# Altium project RP2040_PCB_Project.PrjPcb
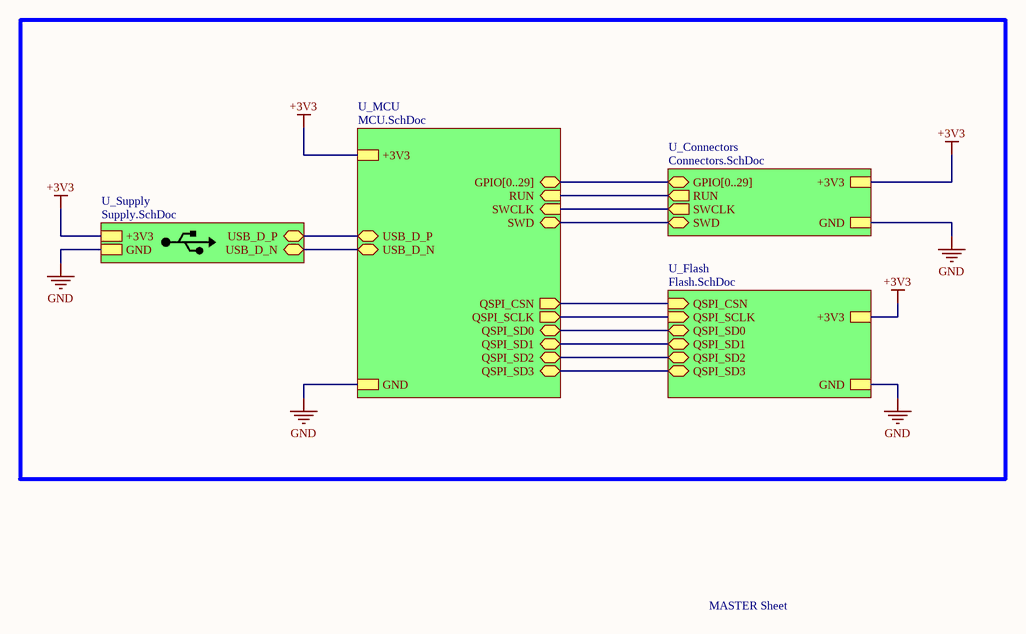
[diagram p0: Master.SchDoc]
Designer: Youssif Hossam; Project_name: RP2040 PCB Board
5 sheets, 29 parts. Net scope: hierarchical (ports join the sheet entries above them; power ports are global).
Board file: PCB1.PcbDoc
Sheets:
  Master.SchDoc
    U_Connectors = Connectors.SchDoc
    U_Flash = Flash.SchDoc
    U_MCU = MCU.SchDoc
    U_Supply = Supply.SchDoc

## Sheet Master.SchDoc
size A; SheetNumber: 1; SheetTotal: 5

### Sub-sheets
U_Connectors = Connectors.SchDoc: GPIO[0..29] (bidir), RUN (out), SWCLK (out), SWD (bidir), +3V3, GND
U_Flash = Flash.SchDoc: QSPI_CSN (in), QSPI_SCLK (in), QSPI_SD0 (bidir), QSPI_SD1 (bidir), QSPI_SD2 (bidir), QSPI_SD3 (bidir), +3V3, GND
U_MCU = MCU.SchDoc: USB_D_P (bidir), USB_D_N (bidir), GPIO[0..29] (bidir), RUN (in), SWCLK (in), SWD (bidir), QSPI_CSN (out), QSPI_SCLK (out), QSPI_SD0 (bidir), QSPI_SD1 (bidir), QSPI_SD2 (bidir), QSPI_SD3 (bidir), +3V3, GND
U_Supply = Supply.SchDoc: USB_D_P (bidir), USB_D_N (bidir), +3V3, GND

### Nets
+3V3: sheet U_Connectors/+3V3, sheet U_Flash/+3V3, sheet U_MCU/+3V3, sheet U_Supply/+3V3
GND: sheet U_Connectors/GND, sheet U_Flash/GND, sheet U_MCU/GND, sheet U_Supply/GND
CS: sheet U_Flash/QSPI_CSN, sheet U_MCU/QSPI_CSN
IO0: sheet U_Flash/QSPI_SD0, sheet U_MCU/QSPI_SD0
IO1: sheet U_Flash/QSPI_SD1, sheet U_MCU/QSPI_SD1
IO2: sheet U_Flash/QSPI_SD2, sheet U_MCU/QSPI_SD2
IO3: sheet U_Flash/QSPI_SD3, sheet U_MCU/QSPI_SD3
QSPI_SCLK: sheet U_Flash/QSPI_SCLK, sheet U_MCU/QSPI_SCLK
RUN: sheet U_Connectors/RUN, sheet U_MCU/RUN
SWCLK: sheet U_Connectors/SWCLK, sheet U_MCU/SWCLK
SWD: sheet U_Connectors/SWD, sheet U_MCU/SWD
USB_D_N: sheet U_MCU/USB_D_N, sheet U_Supply/USB_D_N
USB_D_P: sheet U_MCU/USB_D_P, sheet U_Supply/USB_D_P

### Buses and harness runs
bus sheet U_Connectors/GPIO[0..29] = sheet U_MCU/GPIO[0..29]

### Notes on the sheet
- MASTER Sheet

## Sheet Connectors.SchDoc
size A; SheetNumber: 5; SheetTotal: 5
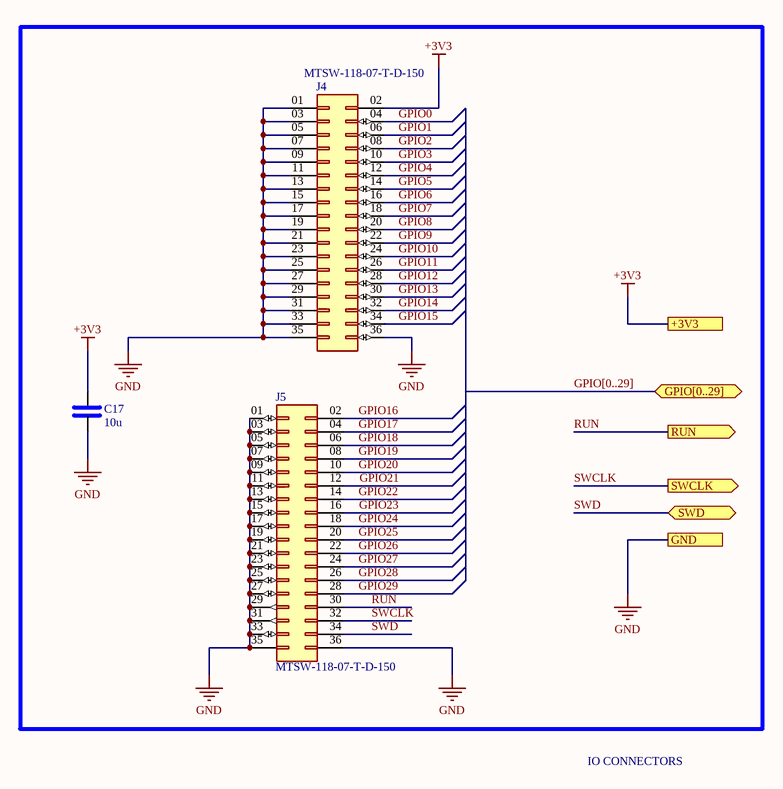
[diagram p1: Connectors.SchDoc]

### Parts
C17  10u  [VJ0805]
J4  MTSW-118-07-T-D-150  [SAMTEC_MTSW-118-07-T-D-150]
J5  MTSW-118-07-T-D-150  [SAMTEC_MTSW-118-07-T-D-150]

### Ports
+3V3 (see Master[4B], Flash[4B], MCU[1A], Supply[4B]), GND (see Master[4B], Flash[4C], MCU[1B], Supply[4C]), GPIO[0..29] (bidir, see Master[3B], MCU[4C]), RUN (out, see Master[3B], MCU[4D]), SWCLK (out, see Master[3B], MCU[4D]), SWD (bidir, see Master[3B], MCU[4D])

### Nets
+3V3: C17.2 J4.02 ; port +3V3
GND: C17.1 J4.01 J4.03 J4.05 J4.07 J4.09 J4.11 J4.13 J4.15 J4.17 J4.19 J4.21 J4.23 J4.25 J4.27 J4.29 J4.31 J4.33 J4.35 J4.36 J5.01 J5.03 J5.05 J5.07 J5.09 J5.11 J5.13 J5.15 J5.17 J5.19 J5.21 J5.23 J5.25 J5.27 J5.29 J5.31 J5.33 J5.35 J5.36 ; port GND
GPIO0: J4.04
GPIO1: J4.06
GPIO2: J4.08
GPIO3: J4.10
GPIO4: J4.12
GPIO5: J4.14
GPIO6: J4.16
GPIO7: J4.18
GPIO8: J4.20
GPIO9: J4.22
GPIO10: J4.24
GPIO11: J4.26
GPIO12: J4.28
GPIO13: J4.30
GPIO14: J4.32
GPIO15: J4.34
GPIO16: J5.02
GPIO17: J5.04
GPIO18: J5.06
GPIO19: J5.08
GPIO20: J5.10
GPIO21: J5.12
GPIO22: J5.14
GPIO23: J5.16
GPIO24: J5.18
GPIO25: J5.20
GPIO26: J5.22
GPIO27: J5.24
GPIO28: J5.26
GPIO29: J5.28
RUN: J5.30 ; port RUN
SWCLK: J5.32 ; port SWCLK
SWD: J5.34 ; port SWD

### Buses and harness runs
bus GPIO[0..29] = port GPIO[0..29]

### Notes on the sheet
- IO CONNECTORS

### Library data of the parts
C17 = 0805 SMD Capacitor: Ceramic Capacitor, Multilayer, Ceramic, 25V, 10% +Tol, 10% -Tol, X5R, 15% TC, 10uF, Surface Mount, 0805; Manufacturer: Murata; Manufacturer Part Number: GRM21BR61E106KA73K; Multilayer: Yes; ComponentLink1Description: Link; ComponentLink1URL: *; Supplier: Future Electronics; Supplier Part Number: 9092991; RoHS: Yes; Category: Ceramic Capacitors; Stock: 40000; Pricing: 10000=0.0248, 20000=0.0245, 30000=0.0242, 40000=0.0241, 50000=0.0236 (USD); Mounting Technology: Surface Mount; Pins: 2; Dielectric Material: Ceramic; Package Shape: Rectangular; Case/Package: 0805; Terminal Finish: Nickel; Min Operating Temperature: -55°C; Max Operating Temperature: 85°C; JESD-609 Code: e3; Value: 10uF; Capacitor Type: Ceramic; Tolerance  (fill in as +-): 10%; Package Style: SMTMeter; Packaging: Tape and Reel; Tolerance (fill in as +-): 10%; Rated DC Voltage (URdc): 25V; Temperature Characteristics Code: X5R; Termination: Wraparound; Length: 2mm; Width: 1.25mm; Height: 1.25mm; Reach SVHC Compliant: Yes; RoHS Compliant: Yes; ComponentLink2URL: https://datasheet.ciiva.com:443/pdfs/VipMasterIC/IC/MURE/MURE-S-A0004349797/MURE-S-A0004361627-1.pdf?src-supplier=IHS+Markit; ComponentLink2Description: https://datasheet.ciiva.com:443/pdfs/VipMasterIC/IC/MURE/MURE-S-A0004349797/MURE-S-A0004361627-1.pdf?src-supplier=IHS+Markit; ComponentLink3URL: http://www.mouser.com/ds/2/281/c02e-2905.pdf?src-supplier=Mouser; ComponentLink3Description: http://www.mouser.com/ds/2/281/c02e-2905.pdf?src-supplier=Mouser; ComponentLink4URL: https://datasheet.octopart.com/GRM21BR61E106KA73K-Murata-datasheet-149523495.pdf?src-supplier=Newark; ComponentLink4Description: https://datasheet.octopart.com/GRM21BR61E106KA73K-Murata-datasheet-149523495.pdf?src-supplier=Newark; ComponentLink5URL: https://datasheet.octopart.com/GRM21BR61E106KA73K-Murata-datasheet-99353849.pdf?src-supplier=Future+Electronics; ComponentLink5Description: https://datasheet.octopart.com/GRM21BR61E106KA73K-Murata-datasheet-99353849.pdf?src-supplier=Future+Electronics; ComponentLink6URL: http://search.murata.co.jp/Ceramy/image/img/A01X/G101/ENG/GRM21BR61E106KA73-01.pdf?src-supplier=Digikey; ComponentLink6Description: http://search.murata.co.jp/Ceramy/image/img/A01X/G101/ENG/GRM21BR61E106KA73-01.pdf?src-supplier=Digikey; ComponentLink7URL: https://search.murata.co.jp/Ceramy/image/img/A01X/G101/ENG/GRM21BR61E106KA73-01.pdf?src-supplier=Digikey; ComponentLink7Description: https://search.murata.co.jp/Ceramy/image/img/A01X/G101/ENG/GRM21BR61E106KA73-01.pdf?src-supplier=Digikey; ComponentLink8URL: https://datasheet.octopart.com/GRM21BR61E106KA73K-Murata-datasheet-165579666.pdf?src-supplier=TME; ComponentLink8Description: https://datasheet.octopart.com/GRM21BR61E106KA73K-Murata-datasheet-165579666.pdf?src-supplier=TME
J4 J5 = MTSW-118-07-T-D-150: Package: None; Price: None; Value: *; MP: MTSW-118-07-T-D-150; Availability: Unavailable

## Sheet Flash.SchDoc
size A; SheetNumber: 4; SheetTotal: 5
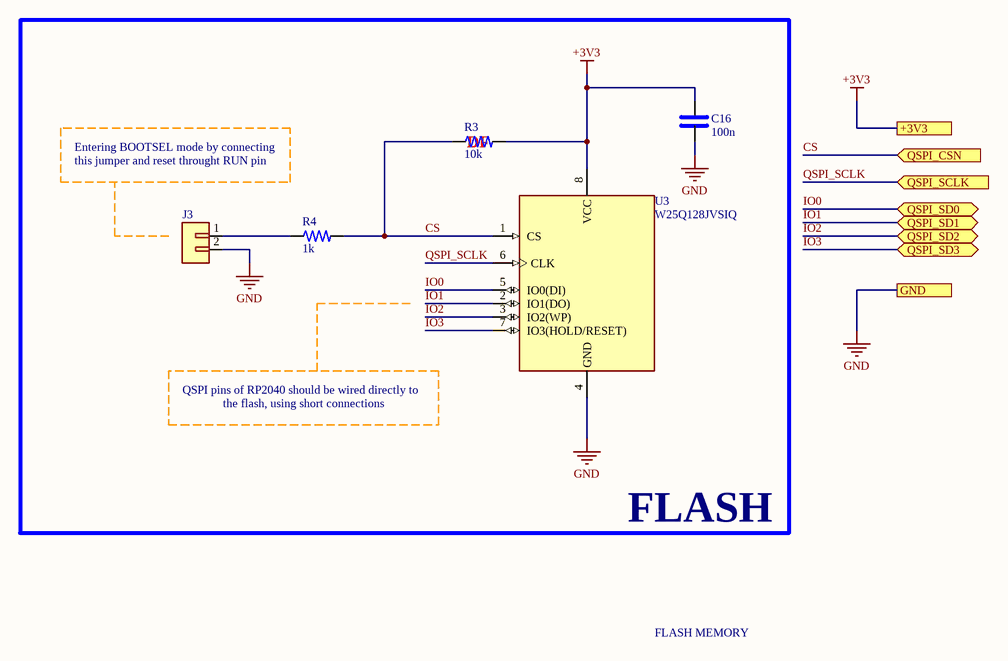
[diagram p2: Flash.SchDoc]

### Parts
C16  100n  [0402 CAP]
J3  2 Position male pin header  [SAMTEC-TMM-101-03-X-D]  (value not drawn)
R3  10k  [0402 RES]
R4  1k  [0402 RES]
U3  W25Q128JVSIQ  [SOIC127P790X216-8N]

### Ports
+3V3 (see Master[4C], Connectors[3B], MCU[1A], Supply[4B]), GND (see Master[4C], Connectors[3C], MCU[1B], Supply[4C]), QSPI_CSN (in, see Master[3C], MCU[1A]), QSPI_SCLK (in, see Master[3C], MCU[1A]), QSPI_SD0 (bidir, see Master[3C], MCU[1A]), QSPI_SD1 (bidir, see Master[3C], MCU[1A]), QSPI_SD2 (bidir, see Master[3C], MCU[1B]), QSPI_SD3 (bidir, see Master[3C], MCU[1B])

### Nets
+3V3: C16.2 R3.2 U3.8(VCC) ; port +3V3
GND: C16.1 J3.2 U3.4(GND) ; port GND
CS: R3.1 R4.2 U3.1(CS) ; port QSPI_CSN
IO0: U3.5(IO0(DI)) ; port QSPI_SD0
IO1: U3.2(IO1(DO)) ; port QSPI_SD1
IO2: U3.3(IO2(WP)) ; port QSPI_SD2
IO3: U3.7(IO3(HOLD/RESET)) ; port QSPI_SD3
QSPI_SCLK: U3.6(CLK) ; port QSPI_SCLK
NetJ3_1: J3.1 R4.1

### Notes on the sheet
- Entering BOOTSEL mode by connecting
- this jumper and reset throught RUN pin
- (near R3) DF
- (near U3) QSPI pins of RP2040 should be wired directly to
- the flash, using short connections
- FLASH
- FLASH MEMORY

### Library data of the parts
C16 = 0402 SMD Capacitor: Ceramic Capacitor, Multilayer, Ceramic, 16V, 10% +Tol, 10% -Tol, X7R, 15% TC, 0.1uF, Surface Mount, 0805; Manufacturer: KEMET; Manufacturer Part Number: C0805C104K4RACTU; Value: 100nF; Multilayer: Yes; ComponentLink1Description: Link; ComponentLink1URL: *; Supplier: Mouser; Supplier Part Number: 80-C0805C104K4R; RoHS: Yes; Category: Ceramic Capacitors; Stock: 114893; Pricing: 1=0.16, 10=0.078, 50=0.078, 100=0.045, 1000=0.034, 10000=0.024 (USD); Mounting Technology: Surface Mount; Pins: 2; Dielectric Material: Ceramic; Package Shape: Rectangular; Case/Package: 0805; Terminal Finish: Nickel; Min Operating Temperature: -55°C; Max Operating Temperature: 125°C; JESD-609 Code: e3; Capacitor Type: Ceramic; Tolerance  (fill in as +-): 10%; Packaging: Tape and Reel; Tolerance (fill in as +-): 10%; Rated DC Voltage (URdc): 16V; Temperature Characteristics Code: X7R; Termination: Wraparound; Reach SVHC Compliant: Yes; RoHS Compliant: Yes; ComponentLink2URL: https://datasheet.ciiva.com:443/pdfs/VipMasterIC/IC/KEME/KEME-S-A0006434815/KEME-S-A0006434815-1.pdf?src-supplier=IHS+Markit; ComponentLink2Description: https://datasheet.ciiva.com:443/pdfs/VipMasterIC/IC/KEME/KEME-S-A0006434815/KEME-S-A0006434815-1.pdf?src-supplier=IHS+Markit; ComponentLink3URL: https://datasheet.ciiva.com/46443/1851736-46443711.pdf?src-supplier=Element14; ComponentLink3Description: https://datasheet.ciiva.com/46443/1851736-46443711.pdf?src-supplier=Element14; ComponentLink4URL: https://datasheet.ciiva.com/46443/1851736-46443710.pdf?src-supplier=Element14; ComponentLink4Description: https://datasheet.ciiva.com/46443/1851736-46443710.pdf?src-supplier=Element14
J3 = SAMTEC-TMM-101-03-X-D
R3 = 0402 SMD Resistor: Fixed Resistor, Metal Glaze/thick Film, 0.125W, 10000ohm, 150V, 10% +/-Tol, 100ppm/Cel, Surface Mount, 0805; Manufacturer: Yageo; Manufacturer Part Number: SR0805KR-0710KL; ComponentLink1Description: Link; ComponentLink1URL: *; Supplier: Digikey; Supplier Part Number: 13-SR0805KR-0710KLCT-ND; RoHS: Yes; Category: Chip SMD Resistors; Stock: 10000; Pricing: 1=0.15, 10=0.08, 50=0.0632, 100=0.0469, 500=0.03468, 1000=0.0306 (USD); ComponentLink2URL: https://datasheet.ciiva.com:443/pdfs/VipMasterIC/IC/YAGO/YAGO-S-A0006645500/YAGO-S-A0006645500-1.pdf?src-supplier=IHS+Markit; ComponentLink2Description: https://datasheet.ciiva.com:443/pdfs/VipMasterIC/IC/YAGO/YAGO-S-A0006645500/YAGO-S-A0006645500-1.pdf?src-supplier=IHS+Markit; ComponentLink3URL: http://www.yageo.com/documents/recent/PYu-SR_20105_RoHS_L_5.pdf?src-supplier=Digikey; ComponentLink3Description: http://www.yageo.com/documents/recent/PYu-SR_20105_RoHS_L_5.pdf?src-supplier=Digikey
R4 = 0402 SMD Resistor: Fixed Resistor, Metal Glaze/thick Film, 0.125W, 1000ohm, 150V, 1% +/-Tol, 100ppm/Cel, Surface Mount, 0805; Manufacturer: Yageo; Manufacturer Part Number: RC0805FR-071KL; Additional Feature: LASER TRIMMABLE; Power: 125mW; Rated Temperature: 70°C; Value: 1kR; Temperature Coefficient: 100ppm/°C; Package Height: 0.5mm; Package Length: 2mm; Package Width: 1.25mm; ComponentLink1Description: Link; ComponentLink1URL: *; Supplier: Future Electronics; Supplier Part Number: 8126013; RoHS: Yes; Category: Chip SMD Resistors; Stock: 1400000; Pricing: 5000=0.0028, 25000=0.0027, 100000=0.0026, 250000=0.0025, 625000=0.0024 (USD); Mounting Technology: Surface Mount; Pins: 2; Package Shape: Rectangular; Case/Package: 0805; Terminal Finish: Nickel; Min Operating Temperature: -55°C; Max Operating Temperature: 155°C; JESD-609 Code: e3; Termination: Wraparound; Resistor Type: FIXED RESISTOR; Construction: Chip; Package Style: SMTMeter; Packaging: Tape and Reel; Technology: METAL GLAZE/THICK FILM; Working Voltage: 150V; Reach SVHC Compliant: Yes; RoHS Compliant: Yes; ComponentLink2URL: https://datasheet.ciiva.com:443/pdfs/VipMasterIC/IC/YAGO/YAGO-S-A0008145938/YAGO-S-A0008145938-1.pdf?src-supplier=IHS+Markit; ComponentLink2Description: https://datasheet.ciiva.com:443/pdfs/VipMasterIC/IC/YAGO/YAGO-S-A0008145938/YAGO-S-A0008145938-1.pdf?src-supplier=IHS+Markit; ComponentLink3URL: https://datasheet.ciiva.com/7941/1686128-7941719.pdf?src-supplier=Element14; ComponentLink3Description: https://datasheet.ciiva.com/7941/1686128-7941719.pdf?src-supplier=Element14
U3 = W25Q128JVSIQ: FLASH - NOR Memory IC 128Mb (16M x 8) SPI - Quad I/O, QPI, DTR 133 MHz 8-SOIC; MF: Winbond Electronics; Price: None; Purchase-URL: https://pricing.snapeda.com/search/part/W25Q128JVSIQ/?ref=eda; Check_prices: https://www.snapeda.com/parts/W25Q128JVSIQ/Winbond+Electronics/view-part/?ref=eda; Value: *; MP: W25Q128JVSIQ; Package: SOIC-8 Winbond; SnapEDA_Link: https://www.snapeda.com/parts/W25Q128JVSIQ/Winbond+Electronics/view-part/?ref=snap; Availability: In Stock

## Sheet MCU.SchDoc
size Letter; SheetNumber: 3; SheetTotal: 5
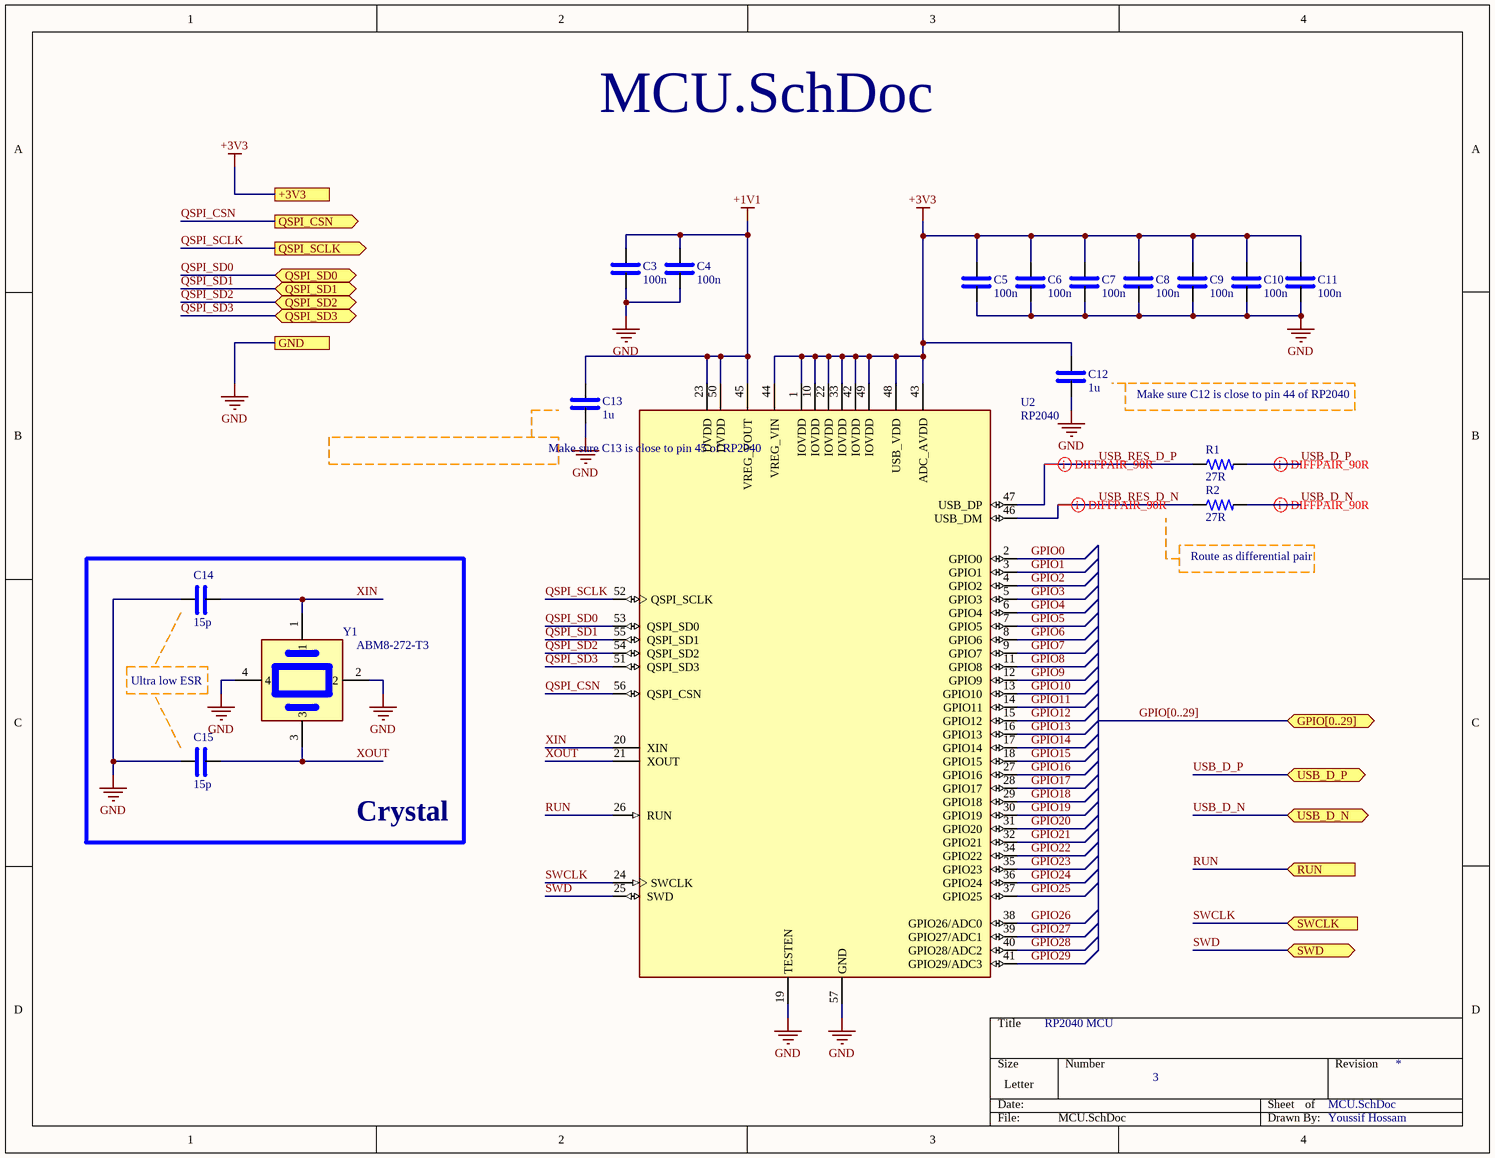
[diagram p3: MCU.SchDoc]

### Parts
C3  100n  [0402 CAP]
C4  100n  [0402 CAP]
C5  100n  [0402 CAP]
C6  100n  [0402 CAP]
C7  100n  [0402 CAP]
C8  100n  [0402 CAP]
C9  100n  [0402 CAP]
C10  100n  [0402 CAP]
C11  100n  [0402 CAP]
C12  1u  [0402 CAP]
C13  1u  [0402 CAP]
C14  15p  [0402 CAP]
C15  15p  [0402 CAP]
R1  27R  [0402 RES]
R2  27R  [0402 RES]
U2  RP2040  [QFN40P700X700X90-57N]
Y1  ABM8-272-T3  [ABM8-272-T3]

### Blocks framed on the sheet
Crystal: C14 C15 Y1

### Ports
+3V3 (see Master[2B], Connectors[3B], Flash[4B], Supply[4B]), GND (see Master[2C], Connectors[3C], Flash[4C], Supply[4C]), GPIO[0..29] (bidir, see Master[3B], Connectors[3C]), QSPI_CSN (out, see Master[3C], Flash[4B]), QSPI_SCLK (out, see Master[3C], Flash[4B]), QSPI_SD0 (bidir, see Master[3C], Flash[4B]), QSPI_SD1 (bidir, see Master[3C], Flash[4B]), QSPI_SD2 (bidir, see Master[3C], Flash[4B]), QSPI_SD3 (bidir, see Master[3C], Flash[4B]), RUN (in, see Master[3B], Connectors[3C]), SWCLK (in, see Master[3B], Connectors[3C]), SWD (bidir, see Master[3B], Connectors[3C]), USB_D_N (bidir, see Master[2C], Supply[4B]), USB_D_P (bidir, see Master[2C], Supply[4B])

### Nets
+1V1: C3.2 C4.2 C13.2 U2.23(DVDD) U2.45(VREG_VOUT) U2.50(DVDD)
+3V3: C5.2 C6.2 C7.2 C8.2 C9.2 C10.2 C11.2 C12.2 U2.1(IOVDD) U2.10(IOVDD) U2.22(IOVDD) U2.33(IOVDD) U2.42(IOVDD) U2.43(ADC_AVDD) U2.44(VREG_VIN) U2.48(USB_VDD) U2.49(IOVDD) ; port +3V3
GND: C3.1 C4.1 C5.1 C6.1 C7.1 C8.1 C9.1 C10.1 C11.1 C12.1 C13.1 C14.2 C15.2 U2.19(TESTEN) U2.57(GND) Y1.2 Y1.4 ; port GND
GPIO0: U2.2(GPIO0)
GPIO1: U2.3(GPIO1)
GPIO2: U2.4(GPIO2)
GPIO3: U2.5(GPIO3)
GPIO4: U2.6(GPIO4)
GPIO5: U2.7(GPIO5)
GPIO6: U2.8(GPIO6)
GPIO7: U2.9(GPIO7)
GPIO8: U2.11(GPIO8)
GPIO9: U2.12(GPIO9)
GPIO10: U2.13(GPIO10)
GPIO11: U2.14(GPIO11)
GPIO12: U2.15(GPIO12)
GPIO13: U2.16(GPIO13)
GPIO14: U2.17(GPIO14)
GPIO15: U2.18(GPIO15)
GPIO16: U2.27(GPIO16)
GPIO17: U2.28(GPIO17)
GPIO18: U2.29(GPIO18)
GPIO19: U2.30(GPIO19)
GPIO20: U2.31(GPIO20)
GPIO21: U2.32(GPIO21)
GPIO22: U2.34(GPIO22)
GPIO23: U2.35(GPIO23)
GPIO24: U2.36(GPIO24)
GPIO25: U2.37(GPIO25)
GPIO26: U2.38(GPIO26/ADC0)
GPIO27: U2.39(GPIO27/ADC1)
GPIO28: U2.40(GPIO28/ADC2)
GPIO29: U2.41(GPIO29/ADC3)
QSPI_CSN: U2.56(QSPI_CSN) ; port QSPI_CSN  [project net CS]
QSPI_SCLK: U2.52(QSPI_SCLK) ; port QSPI_SCLK
QSPI_SD0: U2.53(QSPI_SD0) ; port QSPI_SD0  [project net IO0]
QSPI_SD1: U2.55(QSPI_SD1) ; port QSPI_SD1  [project net IO1]
QSPI_SD2: U2.54(QSPI_SD2) ; port QSPI_SD2  [project net IO2]
QSPI_SD3: U2.51(QSPI_SD3) ; port QSPI_SD3  [project net IO3]
RUN: U2.26(RUN) ; port RUN
SWCLK: U2.24(SWCLK) ; port SWCLK
SWD: U2.25(SWD) ; port SWD
USB_D_N: R2.2 ; port USB_D_N
USB_D_P: R1.2 ; port USB_D_P
USB_RES_D_N: R2.1 U2.46(USB_DM)
USB_RES_D_P: R1.1 U2.47(USB_DP)
XIN: C14.1 U2.20(XIN) Y1.1
XOUT: C15.1 U2.21(XOUT) Y1.3

### Buses and harness runs
bus GPIO[0..29] = port GPIO[0..29]

### Layout directives
differential pair; differential pair class USB: USB_D_N, USB_D_P, USB_RES_D_N, USB_RES_D_P

### Notes on the sheet
- Make sure C12 is close to pin 44 of RP2040
- (near C13) Make sure C13 is close to pin 45 of RP2040
- (near R2) Route as differential pair
- Ultra low ESR
- RP2040 MCU

### Library data of the parts
C3-C11 = 0402 SMD Capacitor: as C16 on sheet Flash; ComponentLink1Description: Link; ComponentLink1URL: *; Supplier: Mouser; Supplier Part Number: 80-C0805C104K4R; RoHS: Yes; Category: Ceramic Capacitors; Stock: 114893; Pricing: 1=0.16, 10=0.078, 50=0.078, 100=0.045, 1000=0.034, 10000=0.024 (USD); Mounting Technology: Surface Mount; Pins: 2; Dielectric Material: Ceramic; Package Shape: Rectangular; Case/Package: 0805; Terminal Finish: Nickel; Min Operating Temperature: -55°C; Max Operating Temperature: 125°C; JESD-609 Code: e3; Capacitor Type: Ceramic; Tolerance  (fill in as +-): 10%; Packaging: Tape and Reel; Tolerance (fill in as +-): 10%; Rated DC Voltage (URdc): 16V; Temperature Characteristics Code: X7R; Termination: Wraparound; Reach SVHC Compliant: Yes; RoHS Compliant: Yes; ComponentLink2URL: https://datasheet.ciiva.com:443/pdfs/VipMasterIC/IC/KEME/KEME-S-A0006434815/KEME-S-A0006434815-1.pdf?src-supplier=IHS+Markit; ComponentLink2Description: https://datasheet.ciiva.com:443/pdfs/VipMasterIC/IC/KEME/KEME-S-A0006434815/KEME-S-A0006434815-1.pdf?src-supplier=IHS+Markit; ComponentLink3URL: https://datasheet.ciiva.com/46443/1851736-46443711.pdf?src-supplier=Element14; ComponentLink3Description: https://datasheet.ciiva.com/46443/1851736-46443711.pdf?src-supplier=Element14; ComponentLink4URL: https://datasheet.ciiva.com/46443/1851736-46443710.pdf?src-supplier=Element14; ComponentLink4Description: https://datasheet.ciiva.com/46443/1851736-46443710.pdf?src-supplier=Element14
C12 C13 = 0402 SMD Capacitor: Ceramic Capacitor, Multilayer, Ceramic, 16V, 10% +Tol, 10% -Tol, X7R, 15% TC, 1uF, Surface Mount, 0805; Manufacturer: KEMET; Manufacturer Part Number: C0805C105K4RACTU; Multilayer: Yes; ComponentLink1Description: Link; ComponentLink1URL: *; Supplier: Mouser; Supplier Part Number: 80-C0805C105K4R; RoHS: Yes; Category: Ceramic Capacitors; Stock: 298617; Pricing: 1=0.11, 10=0.07, 50=0.07, 100=0.046, 1000=0.041, 10000=0.018 (USD); Mounting Technology: Surface Mount; Pins: 2; Dielectric Material: Ceramic; Package Shape: Rectangular; Case/Package: 0805; Terminal Finish: Nickel; Min Operating Temperature: -55°C; Max Operating Temperature: 125°C; JESD-609 Code: e3; Value: 1uF; Capacitor Type: Ceramic; Tolerance  (fill in as +-): 10%; Packaging: Tape and Reel; Tolerance (fill in as +-): 10%; Rated DC Voltage (URdc): 16V; Temperature Characteristics Code: X7R; Termination: Wraparound; Package Style: SMTMeter; Length: 2mm; Width: 1.25mm; Height: 0.9mm; Reach SVHC Compliant: Yes; RoHS Compliant: Yes; ComponentLink2URL: https://datasheet.ciiva.com:443/pdfs/VipMasterIC/IC/KEME/KEME-S-A0008991654/KEME-S-A0008991654-1.pdf?src-supplier=IHS+Markit; ComponentLink2Description: https://datasheet.ciiva.com:443/pdfs/VipMasterIC/IC/KEME/KEME-S-A0008991654/KEME-S-A0008991654-1.pdf?src-supplier=IHS+Markit; ComponentLink3URL: https://datasheet.ciiva.com/6074/1722731-6074364.pdf?src-supplier=Farnell; ComponentLink3Description: https://datasheet.ciiva.com/6074/1722731-6074364.pdf?src-supplier=Farnell; ComponentLink4URL: https://datasheet.ciiva.com/28692/1851736-28692942.pdf?src-supplier=Element14; ComponentLink4Description: https://datasheet.ciiva.com/28692/1851736-28692942.pdf?src-supplier=Element14; ComponentLink5URL: https://datasheet.ciiva.com/14585/70095383-14585511.pdf?src-supplier=Allied+Electronics; ComponentLink5Description: https://datasheet.ciiva.com/14585/70095383-14585511.pdf?src-supplier=Allied+Electronics; ComponentLink6URL: https://datasheet.ciiva.com/14603/70095383-14603388.pdf?src-supplier=Allied+Electronics; ComponentLink6Description: https://datasheet.ciiva.com/14603/70095383-14603388.pdf?src-supplier=Allied+Electronics; ComponentLink7URL: https://datasheet.ciiva.com/45846/docfinderpartnumberc0402c102k5ractu-45846934.pdf?src-supplier=Onlinecomponents.com; ComponentLink7Description: https://datasheet.ciiva.com/45846/docfinderpartnumberc0402c102k5ractu-45846934.pdf?src-supplier=Onlinecomponents.com
C14 C15 = 0402 SMD Capacitor: Ceramic Capacitor, Multilayer, Ceramic, 50V, 1% +Tol, 1% -Tol, C0G, 30ppm/Cel TC, 0.000015uF, Surface Mount, 0805; Manufacturer: Yageo; Manufacturer Part Number: CC0805FRNPO9BN150; Value: 15pF; Multilayer: Yes; ComponentLink1Description: Link; ComponentLink1URL: *; Supplier: Future Electronics; Supplier Part Number: 8396681; RoHS: Yes; Category: Ceramic Capacitors; Stock: 8000; Pricing: 4000=0.0258, 12000=0.0252, 20000=0.0249, 60000=0.0243, 100000=0.0238 (USD); Mounting Technology: Surface Mount; Pins: 2; Dielectric Material: Ceramic; Package Shape: Rectangular; Case/Package: 0805; Terminal Finish: Nickel; Min Operating Temperature: -55°C; Max Operating Temperature: 125°C; JESD-609 Code: e3; Capacitor Type: Ceramic; Tolerance  (fill in as +-): 1%; Package Style: SMTMeter; Packaging: Tape and Reel; Tolerance (fill in as +-): 1%; Rated DC Voltage (URdc): 50V; Temperature Characteristics Code: C0G; Termination: Wraparound; Length: 2mm; Width: 1.25mm; Height: 0.6mm; Reach SVHC Compliant: Yes; RoHS Compliant: Yes; ComponentLink2URL: https://datasheet.ciiva.com:443/pdfs/VipMasterIC/IC/YAGO/YAGO-S-A0009251638/YAGO-S-A0009251638-1.pdf?src-supplier=IHS+Markit; ComponentLink2Description: https://datasheet.ciiva.com:443/pdfs/VipMasterIC/IC/YAGO/YAGO-S-A0009251638/YAGO-S-A0009251638-1.pdf?src-supplier=IHS+Markit; ComponentLink3URL: https://datasheet.ciiva.com/26862/getdatasheetpartid-251794-26862901.pdf?src-supplier=Verical; ComponentLink3Description: https://datasheet.ciiva.com/26862/getdatasheetpartid-251794-26862901.pdf?src-supplier=Verical
R1 R2 = 0402 SMD Resistor: Fixed Resistor, Thin Film, 0.125W, 27ohm, 150V, 0.1% +/-Tol, 25ppm/Cel, Surface Mount, 0805; Manufacturer: Yageo; Manufacturer Part Number: RT0805BRD0727RL; Additional Feature: HIGH PRECISION; Power: 125mW; Rated Temperature: 70°C; Temperature Coefficient: 25ppm/°C; Package Height: 0.5mm; Package Length: 2mm; Package Width: 1.25mm; ComponentLink1Description: Link; ComponentLink1URL: *; Supplier: Digikey; Supplier Part Number: 13-RT0805BRD0727RLCT-ND; RoHS: Yes; Category: Chip SMD Resistors; Stock: 1042; Pricing: 1=0.16, 10=0.122, 50=0.0968, 100=0.0867, 500=0.0663, 1000=0.05814 (USD); Mounting Technology: Surface Mount; Pins: 2; Case/Package: 0805; Min Operating Temperature: -55°C; Max Operating Temperature: 155°C; Resistor Type: FIXED RESISTOR; Construction: Chip; Package Style: SMTMeter; Packaging: Tape and Reel; Value: 27R; Technology: THIN FILM; Termination: Wraparound; Working Voltage: 150V; Reach SVHC Compliant: Yes; RoHS Compliant: Yes; ComponentLink2URL: https://datasheet.ciiva.com:443/pdfs/VipMasterIC/IC/YAGO/YAGO-S-A0008510989/YAGO-S-A0008510989-1.pdf?src-supplier=IHS+Markit; ComponentLink2Description: https://datasheet.ciiva.com:443/pdfs/VipMasterIC/IC/YAGO/YAGO-S-A0008510989/YAGO-S-A0008510989-1.pdf?src-supplier=IHS+Markit; ComponentLink3URL: https://datasheet.ciiva.com/2584/pyu-rt-1-to-0-05-rohs-l-5-2584897.pdf?src-supplier=Digikey; ComponentLink3Description: https://datasheet.ciiva.com/2584/pyu-rt-1-to-0-05-rohs-l-5-2584897.pdf?src-supplier=Digikey; ComponentLink4URL: https://datasheet.ciiva.com/12704/pyu-rt-1-to-0-05-rohs-l-4-12704026.pdf?src-supplier=Mouser; ComponentLink4Description: https://datasheet.ciiva.com/12704/pyu-rt-1-to-0-05-rohs-l-4-12704026.pdf?src-supplier=Mouser
U2 = RP2040: RP2040 chip for Raspberry Pi Pico - ARM® Cortex®-M0+ MCU 32-Bit; SnapEDA_Link: https://www.snapeda.com/parts/RP2040/Raspberry+Pi/view-part/?ref=snap; Package: None; Value: *; MF: Raspberry Pi; MP: RP2040; Check_prices: https://www.snapeda.com/parts/RP2040/Raspberry+Pi/view-part/?ref=eda
Y1 = ABM8-272-T3: 12 MHz Â±30ppm Crystal 10pF 50 Ohms 4-SMD, No Lead; MF: ABRACON; SnapEDA_Link: https://www.snapeda.com/parts/ABM8-272-T3/Abracon/view-part/?ref=snap; Package: SMD-4 Abracon; Value: *; MP: ABM8-272-T3; Check_prices: https://www.snapeda.com/parts/ABM8-272-T3/Abracon/view-part/?ref=eda

## Sheet Supply.SchDoc
size A; SheetNumber: 2; SheetTotal: 5
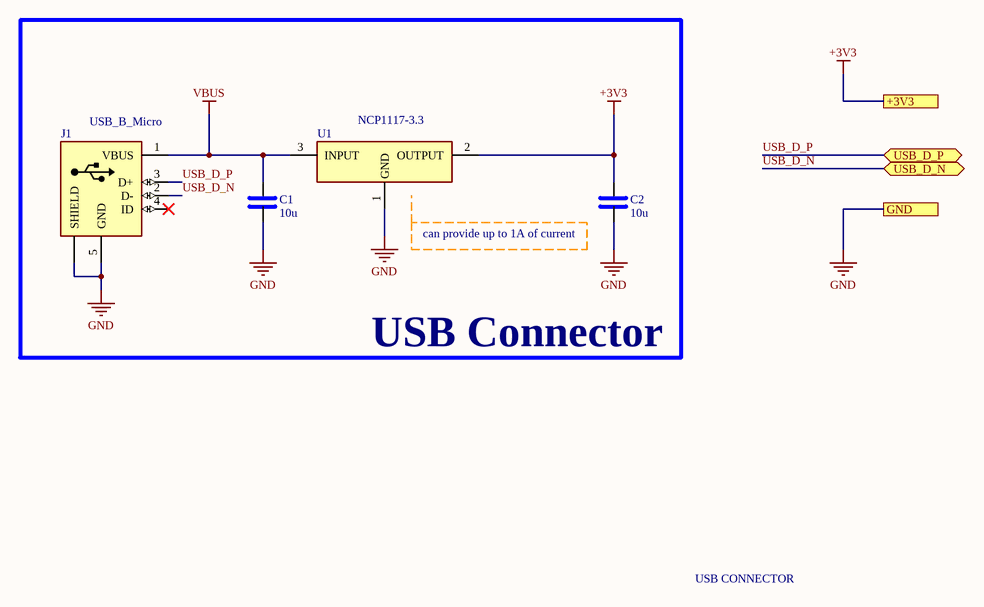
[diagram p4: Supply.SchDoc]

### Parts
C1  10u  [VJ0805]
C2  10u  [VJ0805]
J1  USB_B_Micro  [MOLEX_1050170002]
U1  NCP1117-3.3  [VREG_NCP1117STAT3]

### Ports
+3V3 (see Master[1C], Connectors[3B], Flash[4B], MCU[1A]), GND (see Master[1C], Connectors[3C], Flash[4C], MCU[1B]), USB_D_N (bidir, see Master[2C], MCU[4C]), USB_D_P (bidir, see Master[2C], MCU[4C])

### Nets
+3V3: C2.2 U1.2(OUTPUT) ; port +3V3
GND: C1.1 C2.1 J1.5(GND) J1.SH(SHIELD) U1.1(GND) ; port GND
VBUS: C1.2 J1.1(VBUS) U1.3(INPUT)
USB_D_N: J1.2(D-) ; port USB_D_N
USB_D_P: J1.3(D+) ; port USB_D_P

Not connected (* = marked no-connect by the designer): J1 4(ID)*

### Notes on the sheet
- (near C2) can provide up to 1A of current
- USB Connector
- USB CONNECTOR

### Library data of the parts
C1 C2 = 0805 SMD Capacitor: as C17 on sheet Connectors; ComponentLink1Description: Link; ComponentLink1URL: *; Supplier: Future Electronics; Supplier Part Number: 9092991; RoHS: Yes; Category: Ceramic Capacitors; Stock: 40000; Pricing: 10000=0.0248, 20000=0.0245, 30000=0.0242, 40000=0.0241, 50000=0.0236 (USD); Mounting Technology: Surface Mount; Pins: 2; Dielectric Material: Ceramic; Package Shape: Rectangular; Case/Package: 0805; Terminal Finish: Nickel; Min Operating Temperature: -55°C; Max Operating Temperature: 85°C; JESD-609 Code: e3; Value: 10uF; Capacitor Type: Ceramic; Tolerance  (fill in as +-): 10%; Package Style: SMTMeter; Packaging: Tape and Reel; Tolerance (fill in as +-): 10%; Rated DC Voltage (URdc): 25V; Temperature Characteristics Code: X5R; Termination: Wraparound; Length: 2mm; Width: 1.25mm; Height: 1.25mm; Reach SVHC Compliant: Yes; RoHS Compliant: Yes; ComponentLink2URL: https://datasheet.ciiva.com:443/pdfs/VipMasterIC/IC/MURE/MURE-S-A0004349797/MURE-S-A0004361627-1.pdf?src-supplier=IHS+Markit; ComponentLink2Description: https://datasheet.ciiva.com:443/pdfs/VipMasterIC/IC/MURE/MURE-S-A0004349797/MURE-S-A0004361627-1.pdf?src-supplier=IHS+Markit; ComponentLink3URL: http://www.mouser.com/ds/2/281/c02e-2905.pdf?src-supplier=Mouser; ComponentLink3Description: http://www.mouser.com/ds/2/281/c02e-2905.pdf?src-supplier=Mouser; ComponentLink4URL: https://datasheet.octopart.com/GRM21BR61E106KA73K-Murata-datasheet-149523495.pdf?src-supplier=Newark; ComponentLink4Description: https://datasheet.octopart.com/GRM21BR61E106KA73K-Murata-datasheet-149523495.pdf?src-supplier=Newark; ComponentLink5URL: https://datasheet.octopart.com/GRM21BR61E106KA73K-Murata-datasheet-99353849.pdf?src-supplier=Future+Electronics; ComponentLink5Description: https://datasheet.octopart.com/GRM21BR61E106KA73K-Murata-datasheet-99353849.pdf?src-supplier=Future+Electronics; ComponentLink6URL: http://search.murata.co.jp/Ceramy/image/img/A01X/G101/ENG/GRM21BR61E106KA73-01.pdf?src-supplier=Digikey; ComponentLink6Description: http://search.murata.co.jp/Ceramy/image/img/A01X/G101/ENG/GRM21BR61E106KA73-01.pdf?src-supplier=Digikey; ComponentLink7URL: https://search.murata.co.jp/Ceramy/image/img/A01X/G101/ENG/GRM21BR61E106KA73-01.pdf?src-supplier=Digikey; ComponentLink7Description: https://search.murata.co.jp/Ceramy/image/img/A01X/G101/ENG/GRM21BR61E106KA73-01.pdf?src-supplier=Digikey; ComponentLink8URL: https://datasheet.octopart.com/GRM21BR61E106KA73K-Murata-datasheet-165579666.pdf?src-supplier=TME; ComponentLink8Description: https://datasheet.octopart.com/GRM21BR61E106KA73K-Murata-datasheet-165579666.pdf?src-supplier=TME
J1 = USB_B_Micro: Micro-USB B Receptacle, Bottom Mount, Surface Mount with Solder Tabs, Lead-Free; pin to pad: SH>SH1+SH2+SH3+SH4+SH5+SH6; MF: Molex; MP: 1050170002; SnapEDA_Link: https://www.snapeda.com/parts/1050170002/Molex/view-part/?ref=snap; Package: None; Value: *; Check_prices: https://www.snapeda.com/parts/1050170002/Molex/view-part/?ref=eda
U1 = NCP1117-3.3: Linear Voltage Regulator IC Positive Adjustable 1 Output 1A SOT-223; pin to pad: 2>2+4; MF: ON Semiconductor; MP: NCP1117STAT3; Value: *; Package: None; Purchase-URL: https://pricing.snapeda.com/search/part/NCP1117STAT3/?ref=eda; SnapEDA_Link: https://www.snapeda.com/parts/NCP1117STAT3/Onsemi/view-part/?ref=snap; Price: None; Check_prices: https://www.snapeda.com/parts/NCP1117STAT3/Onsemi/view-part/?ref=eda; Availability: In Stock

## Nets that join several sheets
+3V3: Connectors (C17.2 J4.02), Flash (C16.2 R3.2 U3.8), MCU (17 pins), Supply (C2.2 U1.2)
GND: Connectors (39 pins), Flash (C16.1 J3.2 U3.4), MCU (17 pins), Supply (5 pins)
CS: Flash (R3.1 R4.2 U3.1), MCU (U2.56)
GPIO0: Connectors (J4.04), MCU (U2.2)
GPIO1: Connectors (J4.06), MCU (U2.3)
GPIO2: Connectors (J4.08), MCU (U2.4)
GPIO3: Connectors (J4.10), MCU (U2.5)
GPIO4: Connectors (J4.12), MCU (U2.6)
GPIO5: Connectors (J4.14), MCU (U2.7)
GPIO6: Connectors (J4.16), MCU (U2.8)
GPIO7: Connectors (J4.18), MCU (U2.9)
GPIO8: Connectors (J4.20), MCU (U2.11)
GPIO9: Connectors (J4.22), MCU (U2.12)
GPIO10: Connectors (J4.24), MCU (U2.13)
GPIO11: Connectors (J4.26), MCU (U2.14)
GPIO12: Connectors (J4.28), MCU (U2.15)
GPIO13: Connectors (J4.30), MCU (U2.16)
GPIO14: Connectors (J4.32), MCU (U2.17)
GPIO15: Connectors (J4.34), MCU (U2.18)
GPIO16: Connectors (J5.02), MCU (U2.27)
GPIO17: Connectors (J5.04), MCU (U2.28)
GPIO18: Connectors (J5.06), MCU (U2.29)
GPIO19: Connectors (J5.08), MCU (U2.30)
GPIO20: Connectors (J5.10), MCU (U2.31)
GPIO21: Connectors (J5.12), MCU (U2.32)
GPIO22: Connectors (J5.14), MCU (U2.34)
GPIO23: Connectors (J5.16), MCU (U2.35)
GPIO24: Connectors (J5.18), MCU (U2.36)
GPIO25: Connectors (J5.20), MCU (U2.37)
GPIO26: Connectors (J5.22), MCU (U2.38)
GPIO27: Connectors (J5.24), MCU (U2.39)
GPIO28: Connectors (J5.26), MCU (U2.40)
GPIO29: Connectors (J5.28), MCU (U2.41)
IO0: Flash (U3.5), MCU (U2.53)
IO1: Flash (U3.2), MCU (U2.55)
IO2: Flash (U3.3), MCU (U2.54)
IO3: Flash (U3.7), MCU (U2.51)
QSPI_SCLK: Flash (U3.6), MCU (U2.52)
RUN: Connectors (J5.30), MCU (U2.26)
SWCLK: Connectors (J5.32), MCU (U2.24)
SWD: Connectors (J5.34), MCU (U2.25)
USB_D_N: MCU (R2.2), Supply (J1.2)
USB_D_P: MCU (R1.2), Supply (J1.3)